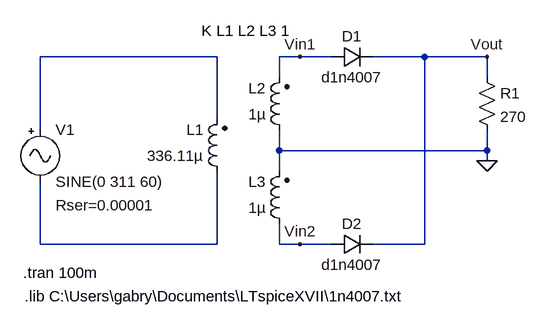
[diagram p0: schematic Draft1.asc]
Draft1.asc, the LTspice schematic file:
Version 4
SHEET 1 880 680
WIRE 320 48 48 48
WIRE 448 48 416 48
WIRE 496 48 448 48
WIRE 640 48 560 48
WIRE 736 48 640 48
WIRE 416 80 416 48
WIRE 736 80 736 48
WIRE 320 144 320 48
WIRE 48 160 48 48
WIRE 416 192 416 160
WIRE 736 192 736 160
WIRE 736 192 416 192
WIRE 736 208 736 192
WIRE 416 224 416 192
WIRE 48 336 48 240
WIRE 320 336 320 224
WIRE 320 336 48 336
WIRE 416 336 416 304
WIRE 448 336 416 336
WIRE 496 336 448 336
WIRE 640 336 640 48
WIRE 640 336 560 336
FLAG 736 208 0
FLAG 736 48 Vout
FLAG 448 48 Vin1
FLAG 448 336 Vin2
SYMBOL Misc\\signal 48 144 R0
WINDOW 123 0 0 Left 0
WINDOW 39 24 132 Left 2
SYMATTR InstName V1
SYMATTR Value SINE(0 311 60)
SYMATTR SpiceLine Rser=0.00001
SYMBOL ind2 336 240 R180
WINDOW 0 36 80 Left 2
WINDOW 3 36 40 Left 2
SYMATTR InstName L1
SYMATTR Value 336.11µ
SYMATTR Type ind
SYMBOL ind2 432 176 R180
WINDOW 0 36 80 Left 2
WINDOW 3 36 40 Left 2
SYMATTR InstName L2
SYMATTR Value 1µ
SYMATTR Type ind
SYMBOL ind2 432 320 R180
WINDOW 0 36 80 Left 2
WINDOW 3 36 40 Left 2
SYMATTR InstName L3
SYMATTR Value 1µ
SYMATTR Type ind
SYMBOL diode 496 64 R270
WINDOW 0 32 32 VTop 2
WINDOW 3 0 32 VBottom 2
SYMATTR InstName D1
SYMATTR Value d1n4007
SYMBOL diode 496 352 R270
WINDOW 0 32 32 VTop 2
WINDOW 3 0 32 VBottom 2
SYMATTR InstName D2
SYMATTR Value d1n4007
SYMBOL res 720 64 R0
SYMATTR InstName R1
SYMATTR Value 270
TEXT 296 8 Left 2 !K L1 L2 L3 1
TEXT 24 416 Left 2 !.lib C:\\Users\\gabry\\Documents\\LTspiceXVII\\1n4007.txt
TEXT 22 380 Left 2 !.tran 100m

The netlist it stands for:
* Draft1.asc
V1 N001 N002 SINE(0 311 60) Rser=0.00001
L1 N002 N001 336.11µ
L2 0 Vin1 1µ
L3 Vin2 0 1µ
D1 Vin1 Vout d1n4007
D2 Vin2 Vout d1n4007
R1 Vout 0 270
.model D D
.lib standard.dio
K L1 L2 L3 1
.lib C:\Users\gabry\Documents\LTspiceXVII\1n4007.txt
.tran 100m
.backanno
.end